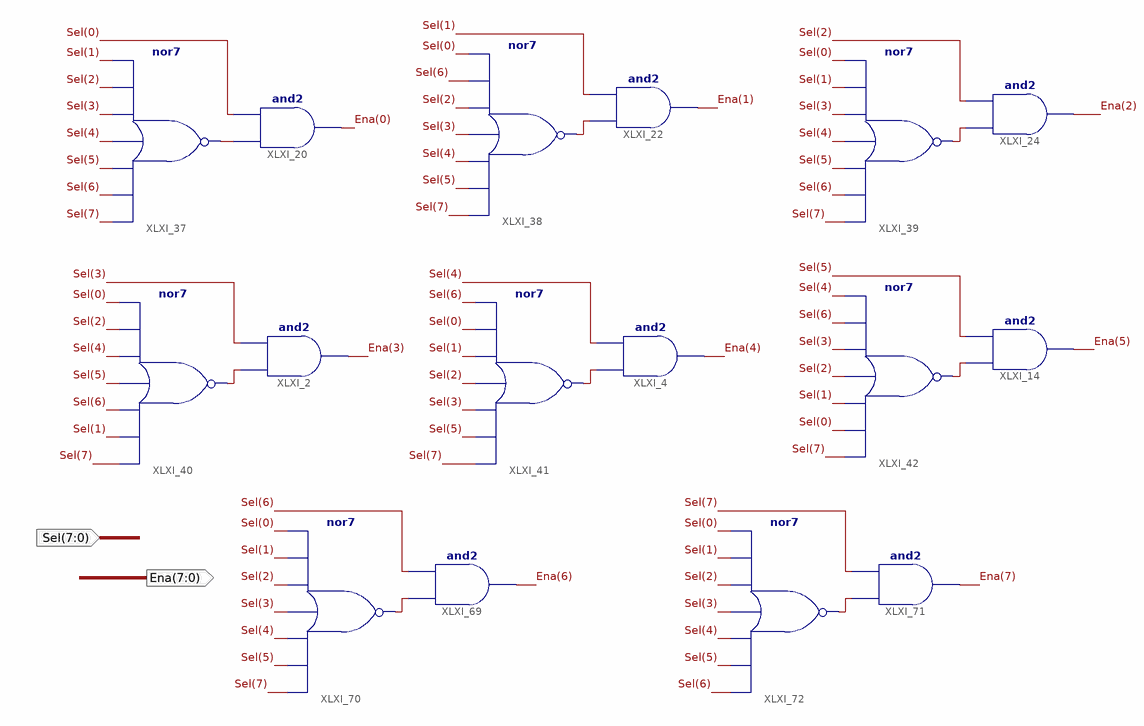
[diagram p0: schematic sheet 1]
// Xilinx ISE schematic ENA_GEN.sch (spartan6) as structural Verilog: 16 symbols, 2 ports
module ENA_GEN (
  input  [7:0] Sel,
  output [7:0] Ena
);

  wire XLXN_141, XLXN_154, XLXN_155, XLXN_156, XLXN_157, XLXN_158, XLXN_290, XLXN_300;

  and XLXI_2 (Ena[3], XLXN_156, Sel[3]);
  nor XLXI_37 (XLXN_141, Sel[7], Sel[6], Sel[5], Sel[4], Sel[3], Sel[2], Sel[1]);
  and XLXI_20 (Ena[0], XLXN_141, Sel[0]);
  nor XLXI_40 (XLXN_156, Sel[7], Sel[1], Sel[6], Sel[5], Sel[4], Sel[2], Sel[0]);
  and XLXI_24 (Ena[2], XLXN_154, Sel[2]);
  nor XLXI_39 (XLXN_154, Sel[7], Sel[6], Sel[5], Sel[4], Sel[3], Sel[1], Sel[0]);
  and XLXI_14 (Ena[5], XLXN_158, Sel[5]);
  nor XLXI_42 (XLXN_158, Sel[7], Sel[0], Sel[1], Sel[2], Sel[3], Sel[6], Sel[4]);
  and XLXI_4 (Ena[4], XLXN_157, Sel[4]);
  nor XLXI_41 (XLXN_157, Sel[7], Sel[5], Sel[3], Sel[2], Sel[1], Sel[0], Sel[6]);
  and XLXI_22 (Ena[1], XLXN_155, Sel[1]);
  nor XLXI_38 (XLXN_155, Sel[7], Sel[5], Sel[4], Sel[3], Sel[2], Sel[6], Sel[0]);
  and XLXI_69 (Ena[6], XLXN_290, Sel[6]);
  nor XLXI_70 (XLXN_290, Sel[7], Sel[5], Sel[4], Sel[3], Sel[2], Sel[1], Sel[0]);
  and XLXI_71 (Ena[7], XLXN_300, Sel[7]);
  nor XLXI_72 (XLXN_300, Sel[6], Sel[5], Sel[4], Sel[3], Sel[2], Sel[1], Sel[0]);
endmodule
